# EAGLE schematic Addon-mapleCUx_HM-RFM69-RFM95-V15-001-TX-Fix (EAGLE 9.2.2)
MAPLE-CUx Large Version
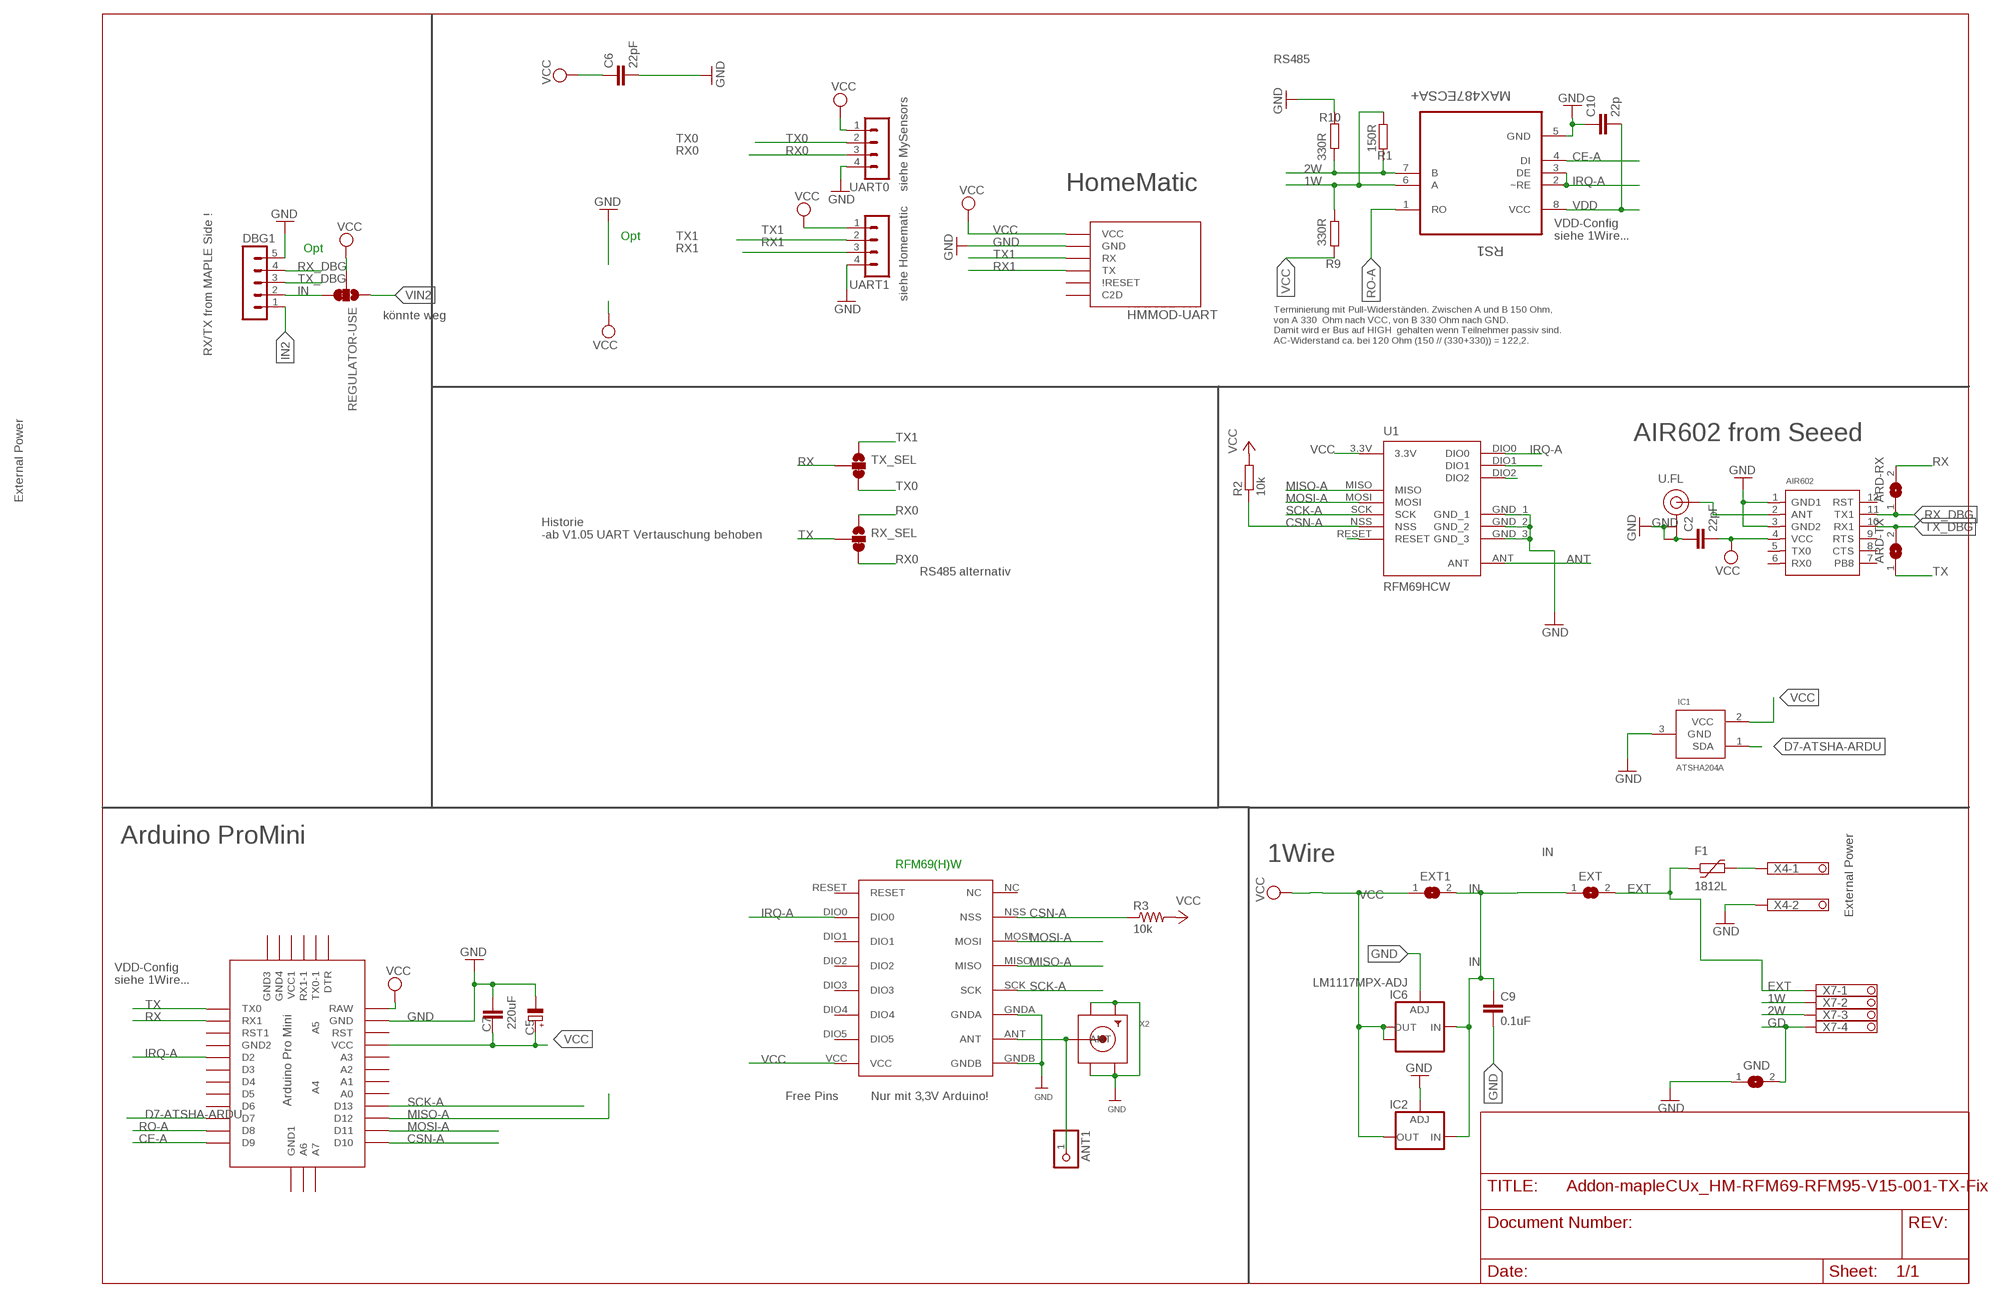
[diagram p0: schematic, sheet 1]

## Parts
AIR602  AIR602  [MODULE12P-2.0-10X12MM]
ANT1  PINHD-1X1  [1X01]
ARD-RX  SJ  [SJ]
ARD-TX  SJ  [SJ]
C2  22pF  C-EUC0805  [C0805]
C5  220uF  CPOL-EUE5-8.5  [E5-8,5]
C6  22pF  C-EUC0805  [C0805]
C7  C-EUC1812  [C1812]
C9  0.1uF  C-EUC1206  [C1206]
C10  22p  C-EUC0805  [C0805]
DBG1  MA05-1  [MA05-1]
EXT  SJ  [SJ]
EXT1  SJ  [SJ]
F1  1812L  [1812L]
GND  SJ  [SJ]
HMMOD-UART  HM-MOD-UARTDIL  [HM-MOD-UART-DIL]
IC1  ATSHA204A  [SOT23]
IC2  LD117ADT50TR  [DPACK]
IC6  LM1117MPX-ADJ  [SOT223]
R1  150R  R-EU_R0805  [R0805]
R2  10k  R-EU_M0805  [M0805]
R3  10k  RESISTOR0805-RES  [0805]
R9  330R  R-EU_R0805  [R0805]
R10  330R  R-EU_R0805  [R0805]
REGULATOR-USE  JUMPER-SMT_3_1-NC_TRACE_SILK  [SMT-JUMPER_3_1-NC_TRACE_SILK]
RFM69W  RFM69HW  [RFM]
RS1  MAX487ECSA+  [SOIC127P600X175-8N]
RX_SEL  JUMPER-SMT_3_1-NC_TRACE_SILK  [SMT-JUMPER_3_1-NC_TRACE_SILK]
TX_SEL  JUMPER-SMT_3_1-NC_TRACE_SILK  [SMT-JUMPER_3_1-NC_TRACE_SILK]
U1  RFM69HCW  [RFM69HCW-XXXS2]
U$2  ABK-PRO-MINI  [ABK-PRO-MINI]
U.FL  U.FL  [U.FL]
UART0  MA04-1  [MA04-1]
UART1  MA04-1  [MA04-1]
X2  SMACONNECTOR_EDGE  [SMA_EDGELAUNCH]
X4  1751248  [1751248]
X7  1751264  [1751264]

## Nets
1W: R1.1 R9.2 RS1.6(A) X7.2
2W: R1.2 R10.1 RS1.7(B) X7.3
AN: AIR602.2(ANT) U.FL.FEED(SIGNAL)
ANT: ANT1.1 RFM69W.ANT U1.ANT X2.P(ANT)
CE-A: RS1.4(DI) U$2.D9
CSN-A: R2.1 R3.1 RFM69W.NSS U1.NSS U$2.D10
D7-ATSHA-ARDU: IC1.1(SDA) U$2.D7
EXT [PWR]: EXT.2 F1.P$1 X7.1
GD [PWR]: GND.2 X7.4
GND [PWR]: AIR602.1(GND1) AIR602.3(GND2) C2.1 C5.- C6.2 C7.1 C9.2 C10.1 DBG1.5 GND.1 HMMOD-UART.2(GND) IC1.3(GND) IC2.1(ADJ) IC6.1(ADJ) R10.2 RFM69W.GNDA RFM69W.GNDB RS1.5(GND) U1.GND_1 U1.GND_2 U1.GND_3 U$2.GND U.FL.1(GND) U.FL.2(GND) UART0.4 UART1.4 X2.GND@1(GND4) X2.GND@2(GND3) X2.GND@3(GND2) X2.GND@4(GND1) X4.2
IN [PWR]: C9.1 DBG1.2 EXT1.2 EXT.1 IC2.3(IN) IC6.3(IN) REGULATOR-USE.3
IN2 [PWR]: DBG1.1
IRQ-A: RFM69W.DIO0 RS1.2(~RE) RS1.3(DE) U1.DIO0 U$2.D2
MISO-A: RFM69W.MISO U1.MISO U$2.D12
MOSI-A: RFM69W.MOSI U1.MOSI U$2.D11
N$2: U1.RESET
N$14: U1.DIO2
N$15: U1.DIO1
N$45 [PWR]: F1.P$2 X4.1
RO-A: RS1.1(RO) U$2.D8
RX: ARD-RX.2 TX_SEL.2 U$2.RX1
RX0: RX_SEL.1 RX_SEL.3 UART0.3
RX1: HMMOD-UART.5(TX) UART1.3
RX_DBG: AIR602.11(TX1) ARD-RX.1 DBG1.4
SCK-A: RFM69W.SCK U1.SCK U$2.D13
TX: ARD-TX.1 RX_SEL.2 U$2.TX0
TX0: TX_SEL.3 UART0.2
TX1: HMMOD-UART.6(RX) TX_SEL.1 UART1.2
TX_DBG: AIR602.10(RX1) ARD-TX.2 DBG1.3
VCC [PWR]: AIR602.4(VCC) C2.2 C5.+ C6.1 C7.2 EXT1.1 HMMOD-UART.1(VCC) IC1.2(VCC) IC2.4(OUT) IC6.2(OUT) IC6.TAB(OUT1) R2.2 R3.2 R9.1 REGULATOR-USE.2 RFM69W.VCC U1.3.3V U$2.RAW U$2.VCC UART0.1 UART1.1
VDD [PWR]: C10.2 RS1.8(VCC)
VIN2 [PWR]: REGULATOR-USE.1
Unconnected: AIR602.5(TX0) AIR602.6(RX0) AIR602.7(PB8) AIR602.8(CTS) AIR602.9(RTS) AIR602.12(RST) HMMOD-UART.3(C2D) HMMOD-UART.4(\!RESET) RFM69W.DIO1 RFM69W.DIO2 RFM69W.DIO3 RFM69W.DIO4 RFM69W.DIO5 RFM69W.NC RFM69W.RESET U$2.A0 U$2.A1 U$2.A2 U$2.A3 U$2.A4 U$2.A5 U$2.A6 U$2.A7 U$2.D3 U$2.D4 U$2.D5 U$2.D6 U$2.DTR U$2.GND1(GND2) U$2.GND2(GND3) U$2.GND3(GND4) U$2.GND4(GND1) U$2.RST U$2.RST1 U$2.RX1-1 U$2.TX0-1 U$2.VCC1

## Notes on the sheet
- RS485
- siehe MySensors | HomeMatic
- Opt
- VDD-Config
  siehe 1Wire...
- Opt
- siehe Homematic
- könnte weg
- Terminierung mit Pull-Widerständen. Zwischen A und B 150 Ohm,
  von A 330  Ohm nach VCC, von B 330 Ohm nach GND. 
  Damit wird er Bus auf HIGH  gehalten wenn Teilnehmer passiv sind.
  AC-Widerstand ca. bei 120 Ohm (150 // (330+330)) = 122,2.
- RX/TX from MAPLE Side !
- AIR602 from Seeed
- External Power
- Historie
  -ab V1.05 UART Vertauschung behoben
- RS485 alternativ
- Arduino ProMini
- 1Wire
- RFM69(H)W
- External Power
- VDD-Config
  siehe 1Wire...
- Free Pins | Nur mit 3,3V Arduino!

## Library data of the parts
AIR602 = AIR602:AIR602
ANT1 = pinhead:PINHD-1X1: PIN HEADER
ARD-RX ARD-TX EXT EXT1 GND = jumper:SJ: SMD solder JUMPER
C2 C6 C7 C9 C10 = rcl:C-EU: CAPACITOR, European symbol
C5 = rcl:CPOL-EU: POLARIZED CAPACITOR, European symbol
DBG1 = con-lstb:MA05-1: PIN HEADER; OC_FARNELL: unknown; OC_NEWARK: unknown
F1 = ptc-littlefuse:1812L
HMMOD-UART = wireless:HM-MOD-UART: eQ3 HM-MOD-UART-AW-SH2 wireless module for 868 MHz. DIL version for mounting with pin header (antenna upwards) and SMD variant available (antenna downwards).
IC1 = Sensor:ATSHA204A
IC2 = v-reg:LD117A?*: Low drop fixed and adjustable positive voltage regulators 1 A Source: http://www.st.com/stonline/products/literature/ds/7194/ld1117axx.pdf
IC6 = lm1117:LM1117MPX-ADJ
R1 R2 R9 R10 = rcl:R-EU_: RESISTOR, European symbol
R3 = doug:RESISTOR: Resistor Basic schematic elements and footprints for 0603, 1206, and PTH resistors.
REGULATOR-USE RX_SEL TX_SEL = SparkFun-Jumpers:JUMPER-SMT_3_1-NC_TRACE: Normally closed trace jumper (1 of 2 connections) This jumper has a trace between two pads so it's normally closed (NC). The other connection is normally open (NO). Use a razor knife to open the connection. For best results follow the IPC guidelines for cutting traces: Cutout at least 0.063 mm (0.005 in). Remove all loose material to clean up the cut area. Seal the cut with an approved epoxy. Reapply solder to reclose the connection, or to close the NO connection.
RFM69W = hoperf:RFM69HW
RS1 = Maxim_By_element14_Batch_1:MAX487ECSA+: Low-Power, Slew-Rate-Limited RS-485/RS-422 Transceivers; MPN: MAX487ECSA+; OC_FARNELL: 9724532; OC_NEWARK: 68K4803; PACKAGE: SOIC-8; SUPPLIER: Maxim
U1 = doug:RFM69H
U$2 = Arduino-clone:ABK-PRO-MINI: ABK Pro-Mini Arduino Clone
U.FL = SparkFun-Connectors:U.FL: SMD Antenna Connector - U.FL 2mm height, 3.0mm x 3.0mm receptacle size. SparkFun Products: SparkFun WiFi Shield - ESP8266 <https://www.sparkfun.com/products/13287> SparkFun ESP8266 Thing <https://www.sparkfun.com/products/13231> SparkFun MiniGen - Pro Mini Signal Generator Shield <https://www.sparkfun.com/products/11420>; PROD_ID: CONN-09193; SF_ID: WRL-09144
UART0 UART1 = con-lstb:MA04-1: PIN HEADER; OC_FARNELL: unknown; OC_NEWARK: unknown
X2 = adafruit:SMACONNECTOR: SMA Connector 90° DIP SMA Connector, 50 Ohm (4UConnector: 07259)
X4 = con-phoenix-350:1751248: MKDS 1/ 2-3,5 Printklemme Nennstrom: 10 A Bemessungsspannung: 160 V Raster: 3,5 mm Polzahl: 2 Montageart: Löten Anschlussart: Schraubanschluss Anschlussrichtung vom Leiter zur Platine: 0° Source: http://eshop.phoenixcontact.com .. 1751248.pdf; OC_FARNELL: unknown; OC_NEWARK: unknown
X7 = con-phoenix-350:1751264: MKDS 1/ 4-3,5 Printklemme Nennstrom: 10 A Bemessungsspannung: 160 V Raster: 3,5 mm Polzahl: 4 Montageart: Löten Anschlussart: Schraubanschluss Anschlussrichtung vom Leiter zur Platine: 0° Source: http://eshop.phoenixcontact.com .. 1751264.pdf; MPN: 1751264; OC_FARNELL: unknown; OC_NEWARK: 10R0934

## Net classes
0 default: width 0.305 mm
1 PWR: width 0.457 mm